# Altium schematic sheet U217-04XN-XXR841_U217-04XN-XXR84.schdoc.schdoc
size 124 x 99 mm
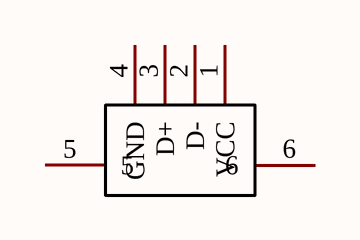
[diagram p0: U217-04XN-XXR841_U217-04XN-XXR84.schdoc.schdoc]

## Parts
USB?  U217-041N-4BV81  [USB-A-SMD_U217-041N-4BV81]  (value not drawn)

## Nets

Not connected (* = marked no-connect by the designer): USB? 1(VCC) 2(D-) 3(D+) 4(GND) 5 6

## Library data of the parts
USB? = U217-041N-4BV81: Manufacturer: XKB Connectivity(中国星坤); Symbol: U217-04XN-XXR84; Add into BOM: yes; Connector Type: Type-A; Gender: 公头; Number of Contacts: 4P; Number of Ports: 1; Current Rating - Power (Max): 1.5A; Name: U217-041N-4BV81; Device: U217-041N-4BV81; LCSC Part Name: Type-A 公头 沉板; Supplier Part: C319178; Manufacturer Part: U217-041N-4BV81; Supplier Footprint: SMD; JLCPCB Part Class: Extended Part; Datasheet: https://atta.szlcsc.com/upload/public/pdf/source/20211015/D42E73CBE112FBE216C7DAC502068881.pdf; Supplier: LCSC; Convert to PCB: yes; Standard: USB 2.0; Mounting Style: 沉板; Contact Material: 黄铜; Contact Plating: 金; Operating Temperature Range: -40℃~+85℃; Welding Temperature (Max): -